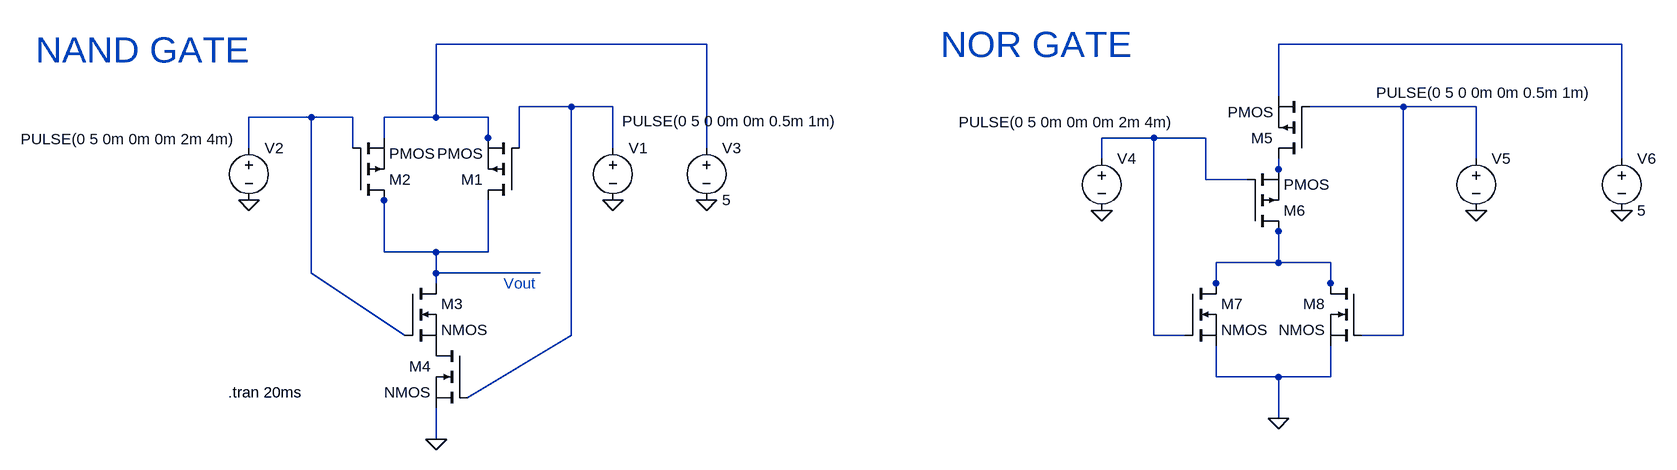
[diagram p0: schematic Nor gate and Nand gate.asc]
Nor gate and Nand gate.asc, the LTspice schematic file:
Version 4.1
SHEET 1 2120 680
WIRE 560 -96 144 -96
WIRE 1968 -96 1440 -96
WIRE 1440 -16 1440 -96
WIRE 352 0 272 0
WIRE 416 0 352 0
WIRE 1632 0 1488 0
WIRE 1744 0 1632 0
WIRE -48 16 -144 16
WIRE 16 16 -48 16
WIRE 144 16 144 -96
WIRE 144 16 64 16
WIRE 224 16 144 16
WIRE 64 48 64 16
WIRE 224 48 224 16
WIRE 1248 48 1168 48
WIRE 1328 48 1248 48
WIRE -144 64 -144 16
WIRE 16 64 16 16
WIRE 272 64 272 0
WIRE 416 64 416 0
WIRE 560 64 560 -96
WIRE 224 80 224 48
WIRE 1168 80 1168 48
WIRE 1744 80 1744 0
WIRE 1968 80 1968 -96
WIRE 1440 96 1440 80
WIRE 1328 112 1328 48
WIRE 1392 112 1328 112
WIRE 1440 112 1440 96
WIRE 64 144 64 128
WIRE 1440 192 1440 176
WIRE 64 224 64 144
WIRE 144 224 64 224
WIRE 224 224 224 144
WIRE 224 224 144 224
WIRE 1440 240 1440 192
WIRE 1440 240 1344 240
WIRE 1520 240 1440 240
WIRE -48 256 -48 16
WIRE 144 256 144 224
WIRE 304 256 144 256
WIRE 144 272 144 256
WIRE 1344 272 1344 240
WIRE 1520 272 1520 240
WIRE 1344 288 1344 272
WIRE 1520 288 1520 272
WIRE 96 352 -48 256
WIRE 352 352 352 0
WIRE 1248 352 1248 48
WIRE 1296 352 1248 352
WIRE 1632 352 1632 0
WIRE 1632 352 1568 352
WIRE 1344 416 1344 368
WIRE 1440 416 1344 416
WIRE 1520 416 1520 368
WIRE 1520 416 1440 416
WIRE 192 448 352 352
WIRE 1440 480 1440 416
WIRE 144 512 144 464
FLAG 144 512 0
FLAG 560 144 0
FLAG -144 144 0
FLAG 416 144 0
FLAG 1440 480 0
FLAG 1168 160 0
FLAG 1744 160 0
FLAG 1968 160 0
SYMBOL pmos 272 144 R180
SYMATTR InstName M1
SYMBOL pmos 16 144 M180
SYMATTR InstName M2
SYMBOL nmos 96 272 R0
SYMATTR InstName M3
SYMBOL nmos 192 368 M0
SYMATTR InstName M4
SYMBOL voltage 416 48 R0
WINDOW 3 345 -26 Right 2
WINDOW 123 0 0 Left 0
WINDOW 39 0 0 Left 0
SYMATTR InstName V1
SYMATTR Value PULSE(0 5 0 0m 0m 0.5m 1m)
SYMBOL voltage -144 48 R0
WINDOW 3 -351 2 Left 2
WINDOW 123 0 0 Left 0
WINDOW 39 0 0 Left 0
SYMATTR InstName V2
SYMATTR Value PULSE(0 5 0m 0m 0m 2m 4m)
SYMBOL voltage 560 48 R0
WINDOW 123 0 0 Left 0
WINDOW 39 0 0 Left 0
SYMATTR InstName V3
SYMATTR Value 5
SYMBOL pmos 1488 80 R180
SYMATTR InstName M5
SYMBOL pmos 1392 192 M180
SYMATTR InstName M6
SYMBOL nmos 1296 272 R0
SYMATTR InstName M7
SYMBOL nmos 1568 272 M0
SYMATTR InstName M8
SYMBOL voltage 1168 64 R0
WINDOW 3 -220 -40 Left 2
WINDOW 123 0 0 Left 0
WINDOW 39 0 0 Left 0
SYMATTR InstName V4
SYMATTR Value PULSE(0 5 0m 0m 0m 2m 4m)
SYMBOL voltage 1744 64 R0
WINDOW 3 -154 -86 Left 2
WINDOW 123 0 0 Left 0
WINDOW 39 0 0 Left 0
SYMATTR InstName V5
SYMATTR Value PULSE(0 5 0 0m 0m 0.5m 1m)
SYMBOL voltage 1968 64 R0
WINDOW 123 0 0 Left 0
WINDOW 39 0 0 Left 0
SYMATTR InstName V6
SYMATTR Value 5
TEXT -176 440 Left 2 !.tran 20ms
TEXT 248 272 Left 2 ;Vout
TEXT -472 -88 Left 5 ;NAND GATE
TEXT 920 -96 Left 5 ;NOR GATE

The netlist it stands for:
* Nor gate and Nand gate.asc
M1 N008 N003 N001 N001 PMOS
M2 N008 N005 N001 N001 PMOS
M3 N008 N005 P001 P001 NMOS
M4 P001 N003 0 0 NMOS
V1 N003 0 PULSE(0 5 0 0m 0m 0.5m 1m)
V2 N005 0 PULSE(0 5 0m 0m 0m 2m 4m)
V3 N001 0 5
M5 N007 N004 N002 N002 PMOS
M6 N009 N006 N007 N007 PMOS
M7 N009 N006 0 0 NMOS
M8 N009 N004 0 0 NMOS
V4 N006 0 PULSE(0 5 0m 0m 0m 2m 4m)
V5 N004 0 PULSE(0 5 0 0m 0m 0.5m 1m)
V6 N002 0 5
.model NMOS NMOS
.model PMOS PMOS
.lib standard.mos
.tran 20ms
* Vout
* NAND GATE
* NOR GATE
.backanno
.end